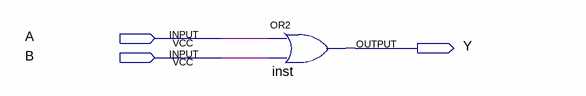
[diagram p0: schematic sheet]
// Quartus schematic lab1_1.bdf as structural Verilog: 1 symbols, 3 pins
module lab1_1 (
  input  A,
  input  B,
  output Y
);

  or inst (Y, A, B);
endmodule
